# EAGLE design sa_amp (EAGLE 9.6.2)
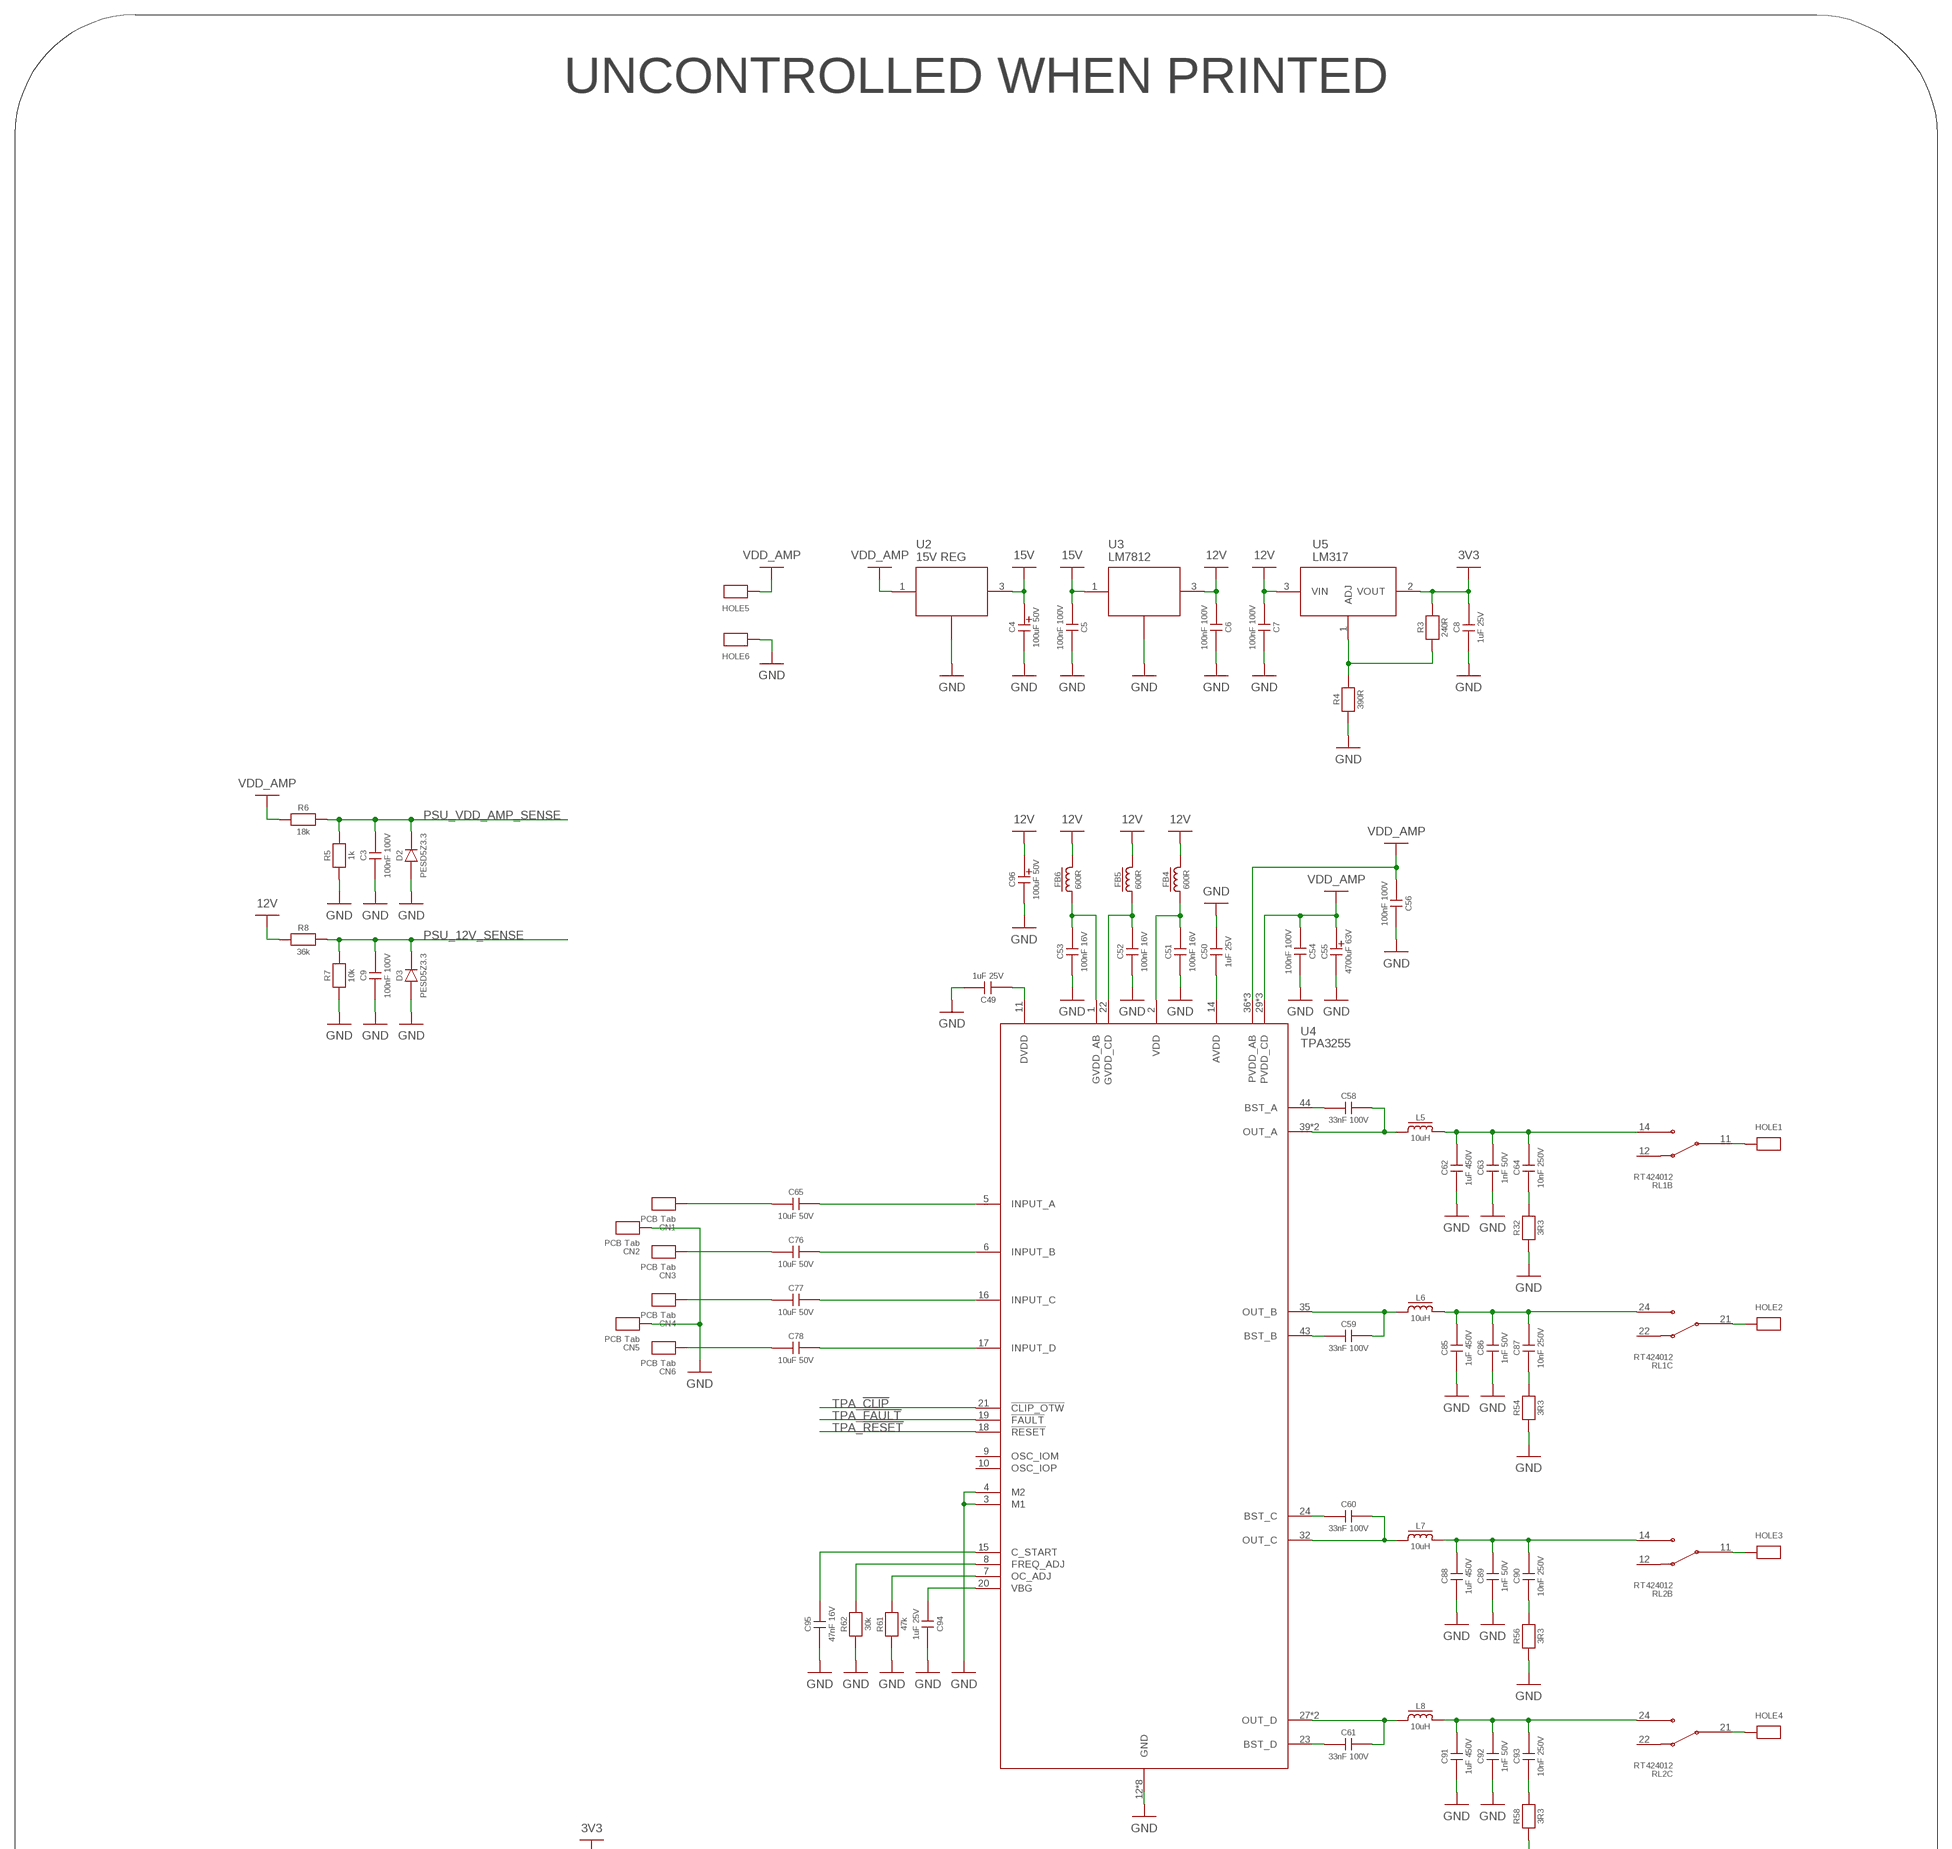
[diagram p0: schematic, sheet 1, part 1 of 2]
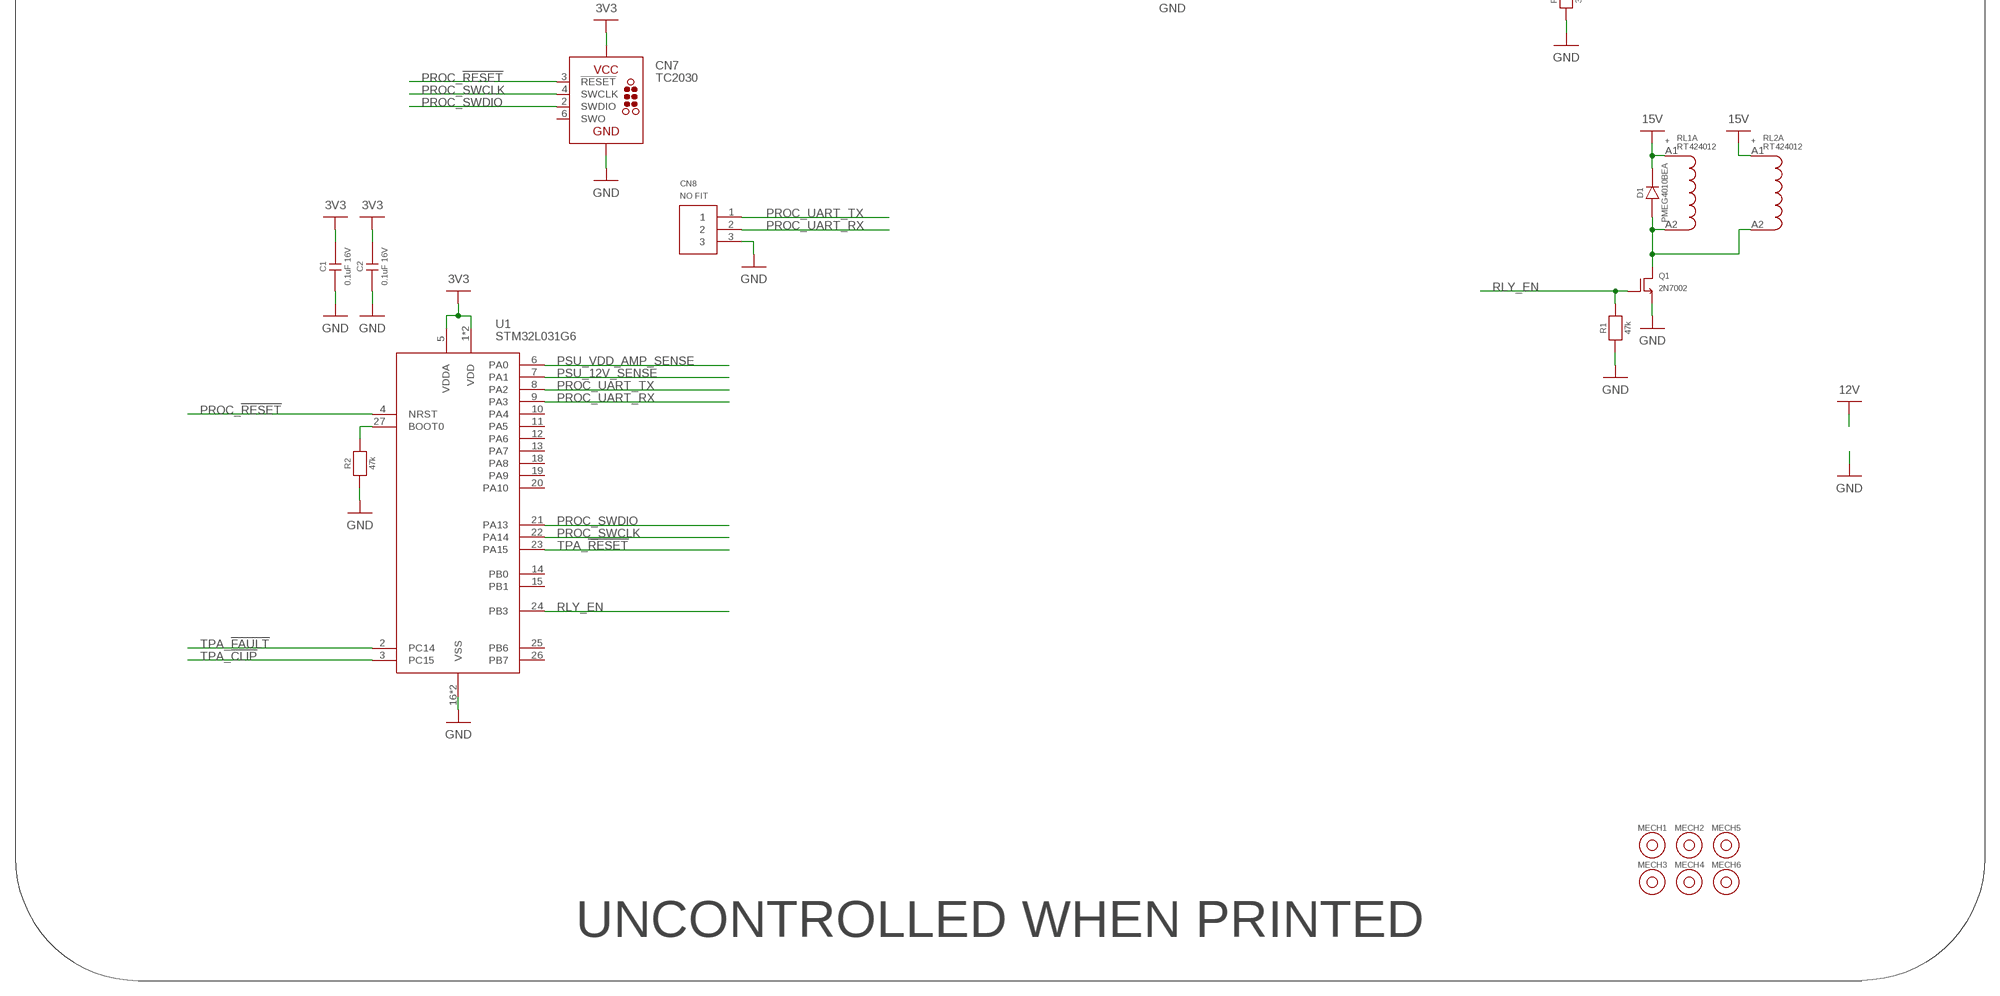
[diagram p1: schematic, sheet 1, part 2 of 2]

## Parts
C1  0.1uF 16V  0603YC104K4T4A  [0603]
C2  0.1uF 16V  0603YC104K4T4A  [0603]
C3  100nF 100V  06031C104KAT2A  [0603]
C4  100uF 50V  107CKR050M  [8MM_RADIAL_3.5MM_PITCH]
C5  100nF 100V  06031C104KAT2A  [0603]
C6  100nF 100V  06031C104KAT2A  [0603]
C7  100nF 100V  06031C104KAT2A  [0603]
C8  1uF 25V  CL10A105KA8NNNC  [0603]
C9  100nF 100V  06031C104KAT2A  [0603]
C49  1uF 25V  CL10A105KA8NNNC  [0603]
C50  1uF 25V  CL10A105KA8NNNC  [0603]
C51  100nF 16V  CL10B104KO8WPNC  [0603]
C52  100nF 16V  CL10B104KO8WPNC  [0603]
C53  100nF 16V  CL10B104KO8WPNC  [0603]
C54  100nF 100V  06031C104KAT2A  [0603]
C55  4700uF 63V  B41231C8478M000  [30MM_RADIAL_10MM_PITCH]
C56  100nF 100V  06031C104KAT2A  [0603]
C58  33nF 100V  C0603C333K1RACTU  [0603]
C59  33nF 100V  C0603C333K1RACTU  [0603]
C60  33nF 100V  C0603C333K1RACTU  [0603]
C61  33nF 100V  C0603C333K1RACTU  [0603]
C62  1uF 450V  ECWFE2W105K  [7X17.5BOX]
C63  1nF 50V  CL10B102KB8NNNC  [0603]
C64  10nF 250V  885342206006  [0603]
C65  10uF 50V  MKS2B051001N00JSSD  [7.2X11BOX]
C76  10uF 50V  MKS2B051001N00JSSD  [7.2X11BOX]
C77  10uF 50V  MKS2B051001N00JSSD  [7.2X11BOX]
C78  10uF 50V  MKS2B051001N00JSSD  [7.2X11BOX]
C85  1uF 450V  ECWFE2W105K  [7X17.5BOX]
C86  1nF 50V  CL10B102KB8NNNC  [0603]
C87  10nF 250V  885342206006  [0603]
C88  1uF 450V  ECWFE2W105K  [7X17.5BOX]
C89  1nF 50V  CL10B102KB8NNNC  [0603]
C90  10nF 250V  885342206006  [0603]
C91  1uF 450V  ECWFE2W105K  [7X17.5BOX]
C92  1nF 50V  CL10B102KB8NNNC  [0603]
C93  10nF 250V  885342206006  [0603]
C94  1uF 25V  CL10A105KA8NNNC  [0603]
C95  47nF 16V  CL10B473KO8NNNC  [0603]
C96  100uF 50V  107CKR050M  [8MM_RADIAL_3.5MM_PITCH]
CN1  PCB Tab  PCB_TAB_SMALL  [PCB_TAB_SMALL]
CN2  PCB Tab  PCB_TAB_SMALL  [PCB_TAB_SMALL]
CN3  PCB Tab  PCB_TAB_SMALL  [PCB_TAB_SMALL]
CN4  PCB Tab  PCB_TAB_SMALL  [PCB_TAB_SMALL]
CN5  PCB Tab  PCB_TAB_SMALL  [PCB_TAB_SMALL]
CN6  PCB Tab  PCB_TAB_SMALL  [PCB_TAB_SMALL]
CN7  TC2030  TC2030-MCP  [TC2030-MCP]
CN8  NO FIT  1X3_HEADER  [3PIN_HEADER]
D1  PMEG4010BEA  [SOD-323]
D2  PESD5Z3.3  [SC-79]
D3  PESD5Z3.3  [SC-79]
FB4  600R  742792651  [0603]
FB5  600R  742792651  [0603]
FB6  600R  742792651  [0603]
HOLE1  PCB Tab  PCB_TAB  [PCB_TAB]
HOLE2  PCB Tab  PCB_TAB  [PCB_TAB]
HOLE3  PCB Tab  PCB_TAB  [PCB_TAB]
HOLE4  PCB Tab  PCB_TAB  [PCB_TAB]
HOLE5  PCB Tab  PCB_TAB  [PCB_TAB]
HOLE6  PCB Tab  PCB_TAB  [PCB_TAB]
L5  10uH  SRP1265A-100M  [SRP1265A]
L6  10uH  SRP1265A-100M  [SRP1265A]
L7  10uH  SRP1265A-100M  [SRP1265A]
L8  10uH  SRP1265A-100M  [SRP1265A]
MECH1  6mm x 3mm  MOUNTHOLE  [MOUNTHOLE_6X3]
MECH2  6mm x 3mm  MOUNTHOLE  [MOUNTHOLE_6X3]
MECH3  6mm x 3mm  MOUNTHOLE  [MOUNTHOLE_6X3]
MECH4  6mm x 3mm  MOUNTHOLE  [MOUNTHOLE_6X3]
MECH5  6mm x 3mm  MOUNTHOLE  [MOUNTHOLE_6X3]
MECH6  6mm x 3mm  MOUNTHOLE  [MOUNTHOLE_6X3]
Q1  2N7002  2N7002P,215  [SOT23-3]
R1  47k  ERJ3EKF4702V  [0603]
R2  47k  ERJ3EKF4702V  [0603]
R3  240R  CRCW0603240RFKEA  [0603]
R4  390R  CRCW0603390RFKEA  [0603]
R5  1k  CRCW06031K00FKEB  [0603]
R6  18k  CRCW060318K0FKEA  [0603]
R7  10k  CRCW060310K0FKTA  [0603]
R8  36k  CRCW060336K0FKEA  [0603]
R32  3R3  RL73H3AR10FTDF  [2512]
R54  3R3  RL73H3AR10FTDF  [2512]
R56  3R3  RL73H3AR10FTDF  [2512]
R58  3R3  RL73H3AR10FTDF  [2512]
R61  47k  ERJ3EKF4702V  [0603]
R62  30k  ERJ3EKF3002V  [0603]
RL1  RT424012  [30MMDPDTRELAY]
RL2  RT424012  [30MMDPDTRELAY]
U1  STM32L031G6  [UFQPN28]
U2  15V REG  SRH05S15  [SRH05]
U3  LM7812  7812CTG  [TO220]
U4  TPA3255  [HTSSOP44]
U5  LM317  LM317LCPK  [SOT89]

## Nets
3V3: C1.2 C2.2 C8.2 CN7.1(VCC) R3.2 U1.1(VDD) U1.5(VDDA) U1.17(VDD) U5.2(VOUT)
12V: C6.1 C7.1 C96.P(A) FB4.2 FB5.2 FB6.2 R8.1 U3.3(VOUT) U5.3(VIN)
15V: C4.P(A) C5.1 D1.K RL1.A1(A:A1) RL2.A1(A:A1) U2.3(VOUT) U3.1(VIN)
GND: C1.1 C2.1 C3.2 C4.N(K) C5.2 C6.2 C7.2 C8.1 C9.2 C49.2 C50.2 C51.1 C52.1 C53.1 C54.2 C55.1(K) C56.2 C62.1 C63.1 C85.1 C86.1 C88.1 C89.1 C91.1 C92.1 C94.2 C95.1 C96.N(K) CN2.1 CN5.1 CN7.5(GND) CN8.3 D2.A D3.A HOLE6.1 Q1.3(S) R1.1 R2.1 R4.1 R5.1 R7.1 R32.1 R54.1 R56.1 R58.1 R61.1 R62.1 U1.16(VSS) U1.28(VSS) U2.2(GND) U3.2(GND) U4.3(M1) U4.4(M2) U4.12(GND) U4.13(GND) U4.25(GND) U4.26(GND) U4.33(GND) U4.34(GND) U4.41(GND) U4.42(GND)
N$1: C50.1 U4.14(AVDD)
N$2: C91.2 C92.2 C93.2 L8.2 RL2.24
N$3: HOLE4.1 RL2.21
N$4: HOLE1.1 RL1.11
N$5: HOLE2.1 RL1.21
N$6: HOLE3.1 RL2.11
N$8: R2.2 U1.27(BOOT0)
N$9: D1.A Q1.2(D) RL1.A2(A:A2) RL2.A2(A:A2)
N$13: R3.1 R4.2 U5.1(ADJ)
N$14: C49.1 U4.11(DVDD)
N$16: C78.1 CN6.1
N$17: C76.1 CN3.1
N$18: C77.1 CN4.1
N$25: C51.2 FB4.1 U4.2(VDD)
N$31: C52.2 FB5.1 U4.22(GVDD_CD)
N$51: C53.2 FB6.1 U4.1(GVDD_AB)
N$52: C61.1 U4.23(BST_D)
N$53: C61.2 L8.1 U4.27(OUT_D) U4.28(OUT_D)
N$54: C60.1 U4.24(BST_C)
N$55: C60.2 L7.1 U4.32(OUT_C)
N$56: C59.1 U4.43(BST_B)
N$57: C59.2 L6.1 U4.35(OUT_B)
N$58: C58.1 U4.44(BST_A)
N$59: C58.2 L5.1 U4.39(OUT_A) U4.40(OUT_A)
N$60: C64.1 R32.2
N$61: C65.2 U4.5(INPUT_A)
N$62: C65.1 CN1.1
N$63: C62.2 C63.2 C64.2 L5.2 RL1.14
N$75: C76.2 U4.6(INPUT_B)
N$76: C77.2 U4.16(INPUT_C)
N$77: C78.2 U4.17(INPUT_D)
N$79: C85.2 C86.2 C87.2 L6.2 RL1.24
N$82: C88.2 C89.2 C90.2 L7.2 RL2.14
N$87: C87.1 R54.2
N$88: C90.1 R56.2
N$89: C93.1 R58.2
N$91: C94.1 U4.20(VBG)
N$92: R61.2 U4.7(OC_ADJ)
N$93: R62.2 U4.8(FREQ_ADJ)
N$94: C95.2 U4.15(C_START)
PROC_!RESET: CN7.3(!RESET) U1.4(NRST)
PROC_SWCLK: CN7.4(SWCLK) U1.22(PA14)
PROC_SWDIO: CN7.2(SWDIO) U1.21(PA13)
PROC_UART_RX: CN8.2 U1.9(PA3)
PROC_UART_TX: CN8.1 U1.8(PA2)
PSU_12V_SENSE: C9.1 D3.K R7.2 R8.2 U1.7(PA1)
PSU_VDD_AMP_SENSE: C3.1 D2.K R5.2 R6.2 U1.6(PA0)
RLY_EN: Q1.1(G) R1.2 U1.24(PB3)
TPA_!CLIP: U1.3(PC15) U4.21(!CLIP_OTW)
TPA_!FAULT: U1.2(PC14) U4.19(!FAULT)
TPA_!RESET: U1.23(PA15) U4.18(!RESET)
VDD_AMP: C54.1 C55.2(A) C56.1 HOLE5.1 R6.1 U2.1(VIN) U4.29(PVDD_CD) U4.30(PVDD_CD) U4.31(PVDD_CD) U4.36(PVDD_AB) U4.37(PVDD_AB) U4.38(PVDD_AB)
Unconnected: CN7.6(SWO) RL1.12 RL1.22 RL2.12 RL2.22 U1.10(PA4) U1.11(PA5) U1.12(PA6) U1.13(PA7) U1.14(PB0) U1.15(PB1) U1.18(PA8) U1.19(PA9) U1.20(PA10) U1.25(PB6) U1.26(PB7) U4.9(OSC_IOM) U4.10(OSC_IOP)

## Notes on the sheet
- UNCONTROLLED WHEN PRINTED
- UNCONTROLLED WHEN PRINTED

## Library data of the parts
C1 C2 = c_0603:0603YC104K4T4A: 100000 16V 0.1µF ±10% X7R 0603; DIGIKEY: 478-9382-1-ND; HEIGHT: -; MANUFACTURER: AVX Corporation; PRICE_PER: 0.08000; STOCK: 176486; TEMP_CO: X7R; TOLERANCE: ±10%; VOLTAGE: 16V
C3 C5-C7 C9 C54 C56 = CAPACITORS:06031C104KAT2A: 100nF 100V X7R 10% 0603 MLCC.; DIGIKEY: 478-10047-1-ND; HEIGHT: 1; PRICE_PER: 0.14
C4 C96 = CAPACITORS:107CKR050M: 100uF 50V Electrolytic 20% 8mm radial.; DIGIKEY: 1572-1044-ND; HEIGHT: 14; PRICE_PER: 0.223
C8 C49 C50 C94 = CAPACITORS:CL10A105KA8NNNC: 1uF 25V X5R 10% 0603 MLCC.; DIGIKEY: 1276-1102-1-ND; HEIGHT: 1; PRICE_PER: 0.08
C51-C53 = CAPACITORS:CL10B104KO8WPNC: 100nF 16V X7R 10% 0603 MLCC; DIGIKEY: 1276-6582-1-ND; HEIGHT: 1; PRICE_PER: 0.08
C55 = CAPACITORS:B41231C8478M000: 4700uF 63V Electrolytic 20% 10mm radial.; DIGIKEY: 495-6169-ND; HEIGHT: 37; PRICE_PER: 2.62
C58-C61 = CAPACITORS:C0603C333K1RACTU: 33nF 100V X7R 10% 0603 MLCC.; DIGIKEY: 399-3478-1-ND; HEIGHT: 1; PRICE_PER: 0.214
C62 C85 C88 C91 = CAPACITORS:ECWFE2W105K: 1uF 450V Film 10% box; DIGIKEY: P16845-ND; HEIGHT: 13; PRICE_PER: 0.49
C63 C86 C89 C92 = CAPACITORS:CL10B102KB8NNNC: 1nF 50V X7R 10% 0603 MLCC.; DIGIKEY: 1276-1018-1-ND; HEIGHT: 1; PRICE_PER: 0.08
C64 C87 C90 C93 = CAPACITORS:885342206006: 10nF 250V X7R 10% 0603 MLCC.; DIGIKEY: 732-12168-1-ND; HEIGHT: 1; PRICE_PER: 0.09
C65 C76-C78 = CAPACITORS:MKS2B051001N00JSSD: 10uF 50V FILM +/-5% 7.2 x 11mm BOX; DIGIKEY: 1928-1631-ND; HEIGHT: 16; PRICE_PER: 2.22
C95 = CAPACITORS:CL10B473KO8NNNC: 47nF 16V X7R 10% 0603 MLCC.; DIGIKEY: 1276-2079-1-ND; HEIGHT: 1; PRICE_PER: 0.08
CN1-CN6 = CONNECTORs:PCB_TAB_SMALL: PCB tab for soldering. Built into the PCB.; HEIGHT: 2; PRICE_PER: 0
CN7 = tag-connect:TC2030: TAG-CONNECT ICSP Connector Manufacturer: Tag-Connect <http://www.tag-connect.com> Cable for easy In-Circuit Serial Programming. Designed for Microchip ICD2, suitable for many others. Two variants - one "with legs" (for hands-free fit on PCB) and another "without legs" for quick programming.; HEIGHT: 0; PRICE_PER: 0
CN8 = CONNECTORs:1X3_HEADER: A 1 row, 3 column, 3 pin 0.1" header.; VALUE: 1 X 3 HEADER
D1 = DIODES:PMEG4010BEA: 1A, 40V Schottkey rectifier. SOD323.; DIGIKEY: 1727-5211-1-ND; HEIGHT: 1.2; PRICE_PER: 0.29
D2 D3 = DIODES:PESD5Z3.3: Low capacitance unidirectional ElectroStatic Discharge (ESD) protection diode. 3.3V.; DIGIKEY: 1727-5814-1-ND; HEIGHT: 0.5; PRICE_PER: 0.28
FB4-FB6 = INDUCTORS:742792651: Ferrite Bead 600R at 100MHz 0603.; DIGIKEY: 732-1593-1-ND; HEIGHT: 1; PRICE_PER: 0.13
HOLE1-HOLE6 = CONNECTORs:PCB_TAB: PCB tab for soldering. Built into the PCB.; HEIGHT: 2; PRICE_PER: 0
L5-L8 = INDUCTORS:SRP1265A-100M: Power Inductor (SMD), 10 µH, 10 A, Shielded, 15.5 A, SRP1265A Series, 13.5mm x 12.5mm x 6.2mm; DIGIKEY: SRP1265A-100MCT-ND; HEIGHT: 6.2; PRICE_PER: 1.32
MECH1-MECH6 = MISC:MOUNTHOLE: Mechanical mounting hole.
Q1 = TRANSISTORs:2N7002: N-Channel 60V 360mA (Ta) 350mW (Ta) Surface Mount TO-236AB (SOT23); DIGIKEY: 1727-4692-1-ND; HEIGHT: 1; PRICE_PER: 0.15
R1 R2 R61 = r_0603:ERJ3EKF4702V: 47000 47k 0603 0.1W 1% thick film resistor.; DIGIKEY: P47.0KHCT-ND; PRICE_PER: 0.10000
R3 = r_0603:CRCW0603240RFKEA: 240 ±1% 240 Ohms Thick Film 0.1W, 1/10W 0603; DIGIKEY: 541-240HCT-ND; HEIGHT: 1; MANUFACTURER: Vishay Dale; POWER: 0.1W, 1/10W; PRICE_PER: 0.07000; STOCK: 4057; TOLERANCE: ±1%
R4 = r_0603:CRCW0603390RFKEA: 390 ±1% 390 Ohms Thick Film 0.1W, 1/10W 0603; DIGIKEY: 541-390HCT-ND; HEIGHT: 1; MANUFACTURER: Vishay Dale; POWER: 0.1W, 1/10W; PRICE_PER: 0.07000; STOCK: 1304; TOLERANCE: ±1%
R5 = r_0603:CRCW06031K00FKEB: 1000 ±1% 1k Thick Film 0.1W, 1/10W 0603; DIGIKEY: 541-2985-1-ND; HEIGHT: 1; MANUFACTURER: Vishay Dale; POWER: 0.1W, 1/10W; PRICE_PER: 0.07000; STOCK: 1537; TOLERANCE: ±1%
R6 = r_0603:CRCW060318K0FKEA: 18000 ±1% 18k Thick Film 0.1W, 1/10W 0603; DIGIKEY: 541-18.0KHCT-ND; HEIGHT: 1; MANUFACTURER: Vishay Dale; POWER: 0.1W, 1/10W; PRICE_PER: 0.07000; STOCK: 18000; TOLERANCE: ±1%
R7 = r_0603:CRCW060310K0FKTA: 10000 ±1% 10k Thick Film 0.1W, 1/10W 0603; DIGIKEY: 541-2980-1-ND; HEIGHT: 1; MANUFACTURER: Vishay Dale; POWER: 0.1W, 1/10W; PRICE_PER: 0.12000; STOCK: 50797; TOLERANCE: ±1%
R8 = r_0603:CRCW060336K0FKEA: 36000 ±1% 36k Thick Film 0.1W, 1/10W 0603; DIGIKEY: 541-36.0KHCT-ND; HEIGHT: 1; MANUFACTURER: Vishay Dale; POWER: 0.1W, 1/10W; PRICE_PER: 0.07000; STOCK: 961; TOLERANCE: ±1%
R32 R54 R56 R58 = RESISTORS:RL73H3AR10FTDF: 0.1 0.1R 2512 1W 1%; DIGIKEY: A138604CT-ND; HEIGHT: 1; PRICE_PER: 0.47; VALUE: 0R1
R62 = r_0603:ERJ3EKF3002V: 30000 30k 0603 0.1W 1% thick film resistor.; DIGIKEY: P30.0KHCT-ND; PRICE_PER: 0.10000
RL1 RL2 = ELECTROMECH:RT424012: General Purpose Relay DPDT (2 Form C) 12VDC Coil Through Hole; DIGIKEY: PB967-ND; HEIGHT: 16; PRICE_PER: 1.83
U1 = ICs:STM32L031G6: Access line ultra-low-power 32-bit MCU Arm®-based Cortex®-M0+, up to 32KB Flash, 8KB SRAM, 1KB EEPROM, ADC; DIGIKEY: 497-17485-ND; HEIGHT: 0.7; PRICE_PER: 1.71
U2 = ICs:SRH05S15: Linear Regulator Replacement DC DC Converter 1 Output 15V - - - 400mA 21V - 72V Input; DIGIKEY: 1470-4534-ND; HEIGHT: 10; PRICE_PER: 6
U3 = ICs:78: Linear Voltage Regulator, 78xx, Fixed, Positive, TO-220-3, 1.0 A Fixed Positive Voltage Regulators; FARNELL: 2296054; PRICE_PER: 0.391
U4 = ICs:TPA3255: 315-W Stereo, 600-W Mono PurePath™ Ultra-HD Analog-Input; DIGIKEY: 296-45124-5-ND; HEIGHT: 1.2; PRICE_PER: 8.67
U5 = ICs:LM317: Linear Voltage Regulator, Adjustable, 38V primary input, 1.2V to 32V/100 mA/1 Output; FARNELL: 2323454; PRICE_PER: 0.631

## Board
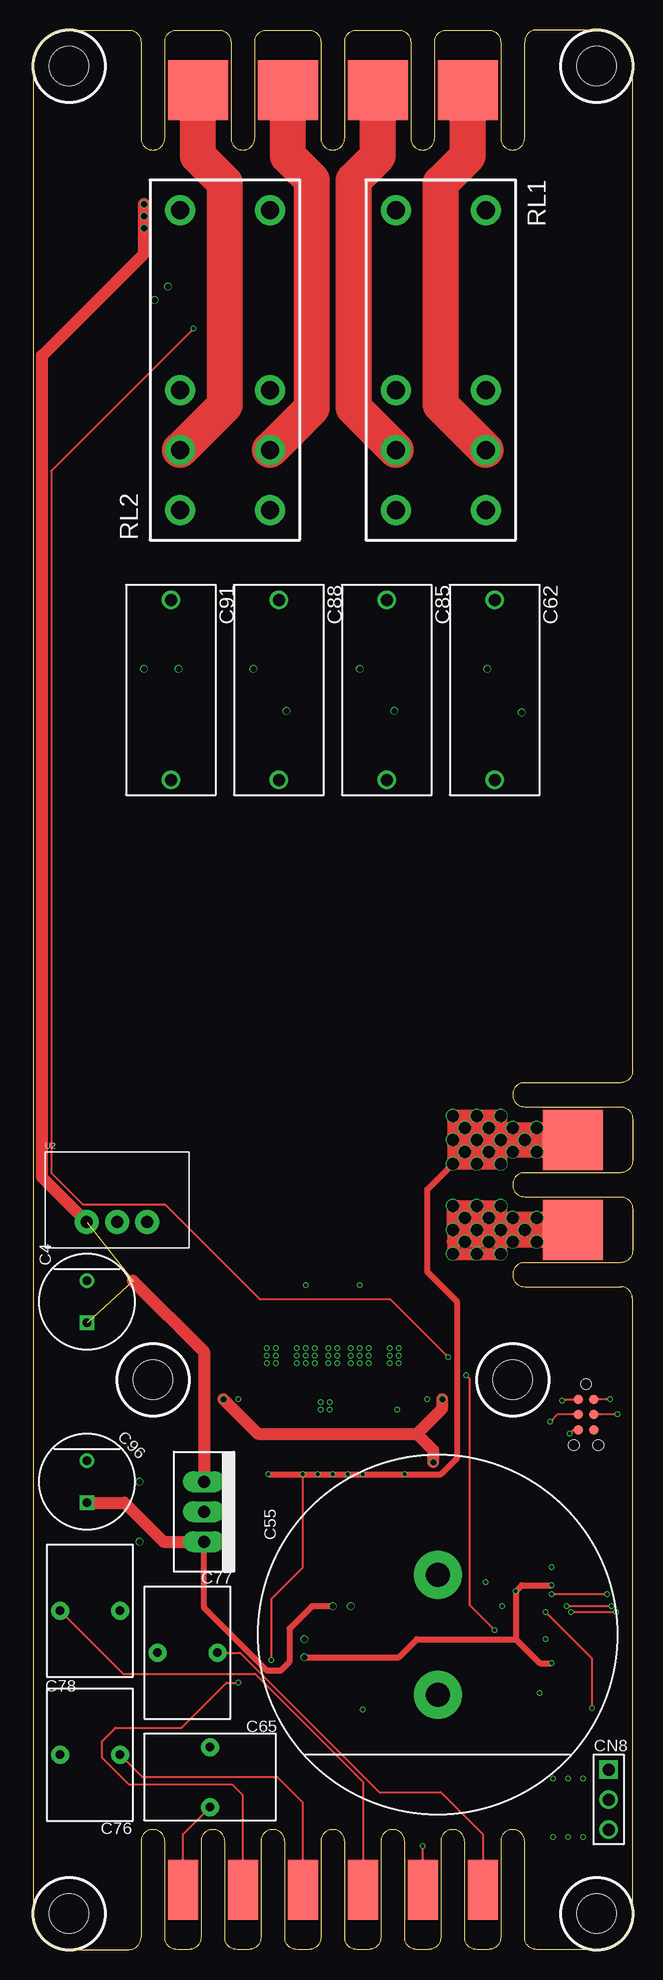
[diagram p2: board, top side]
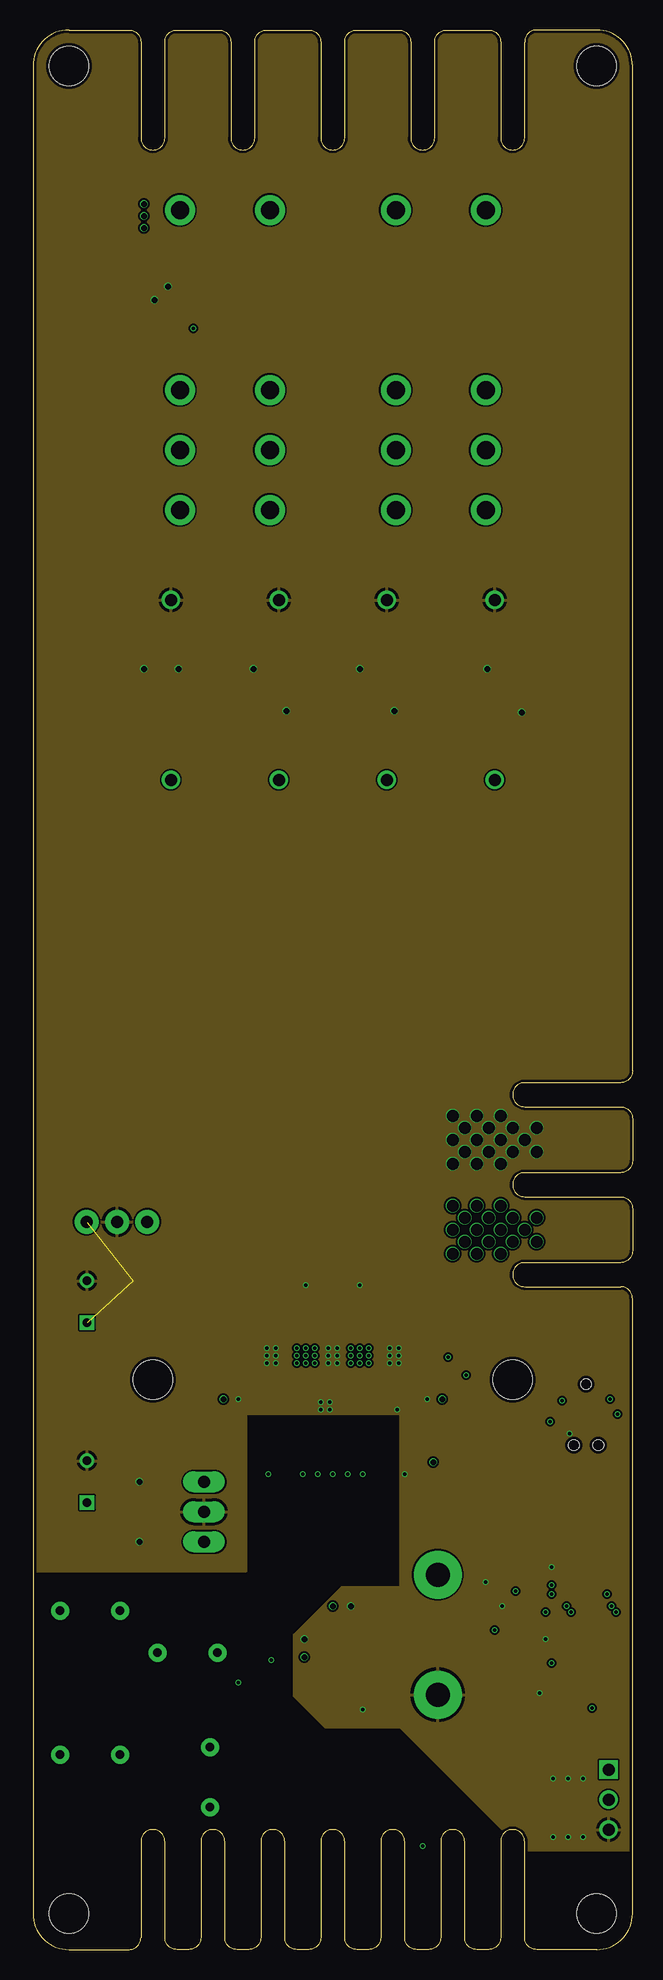
[diagram p3: board, inner layer GND]
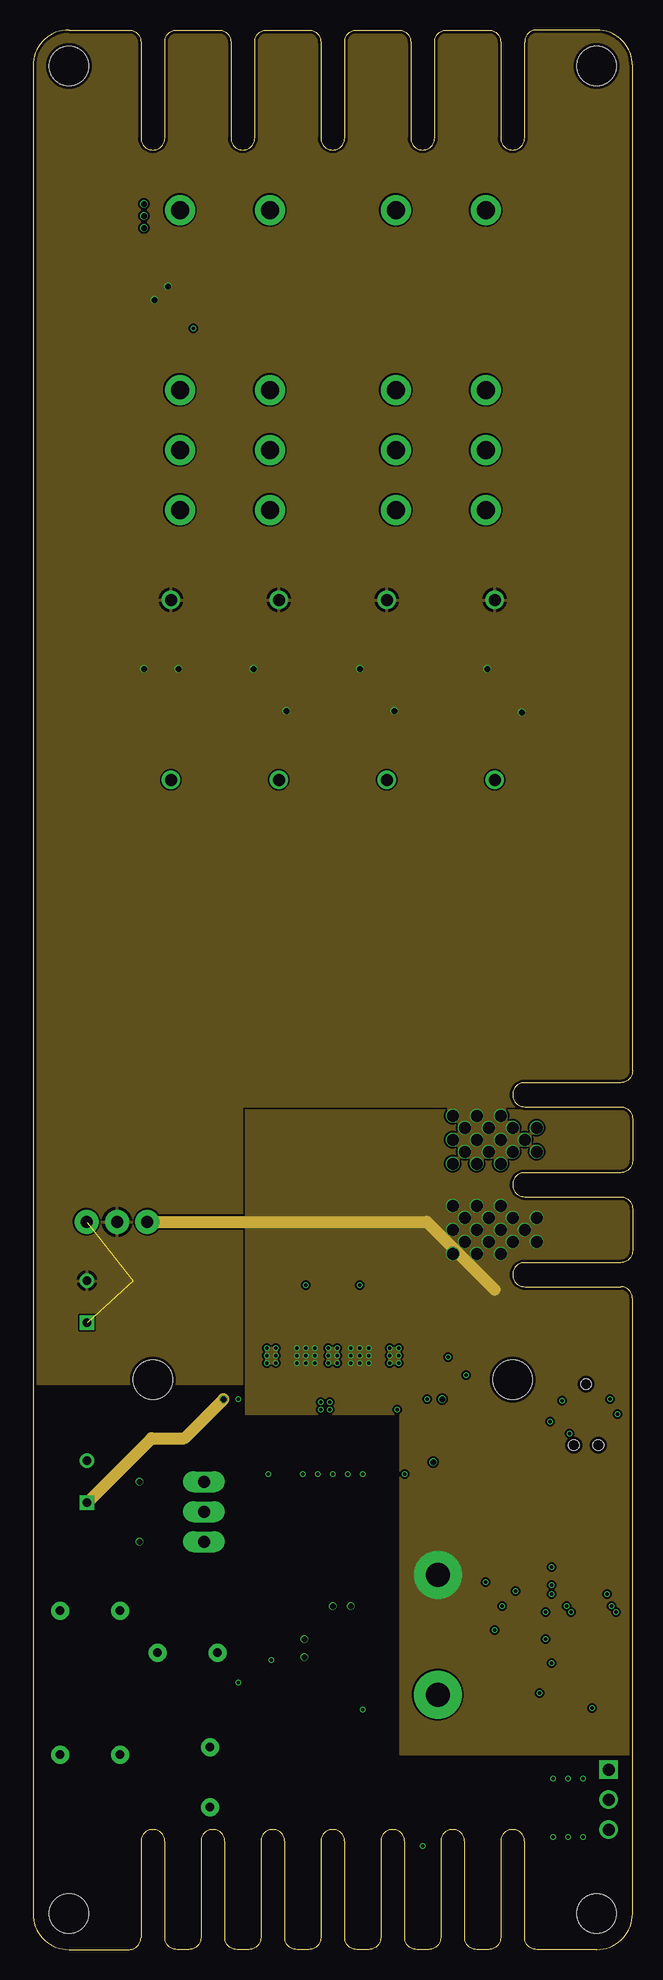
[diagram p4: board, inner layer PWR]
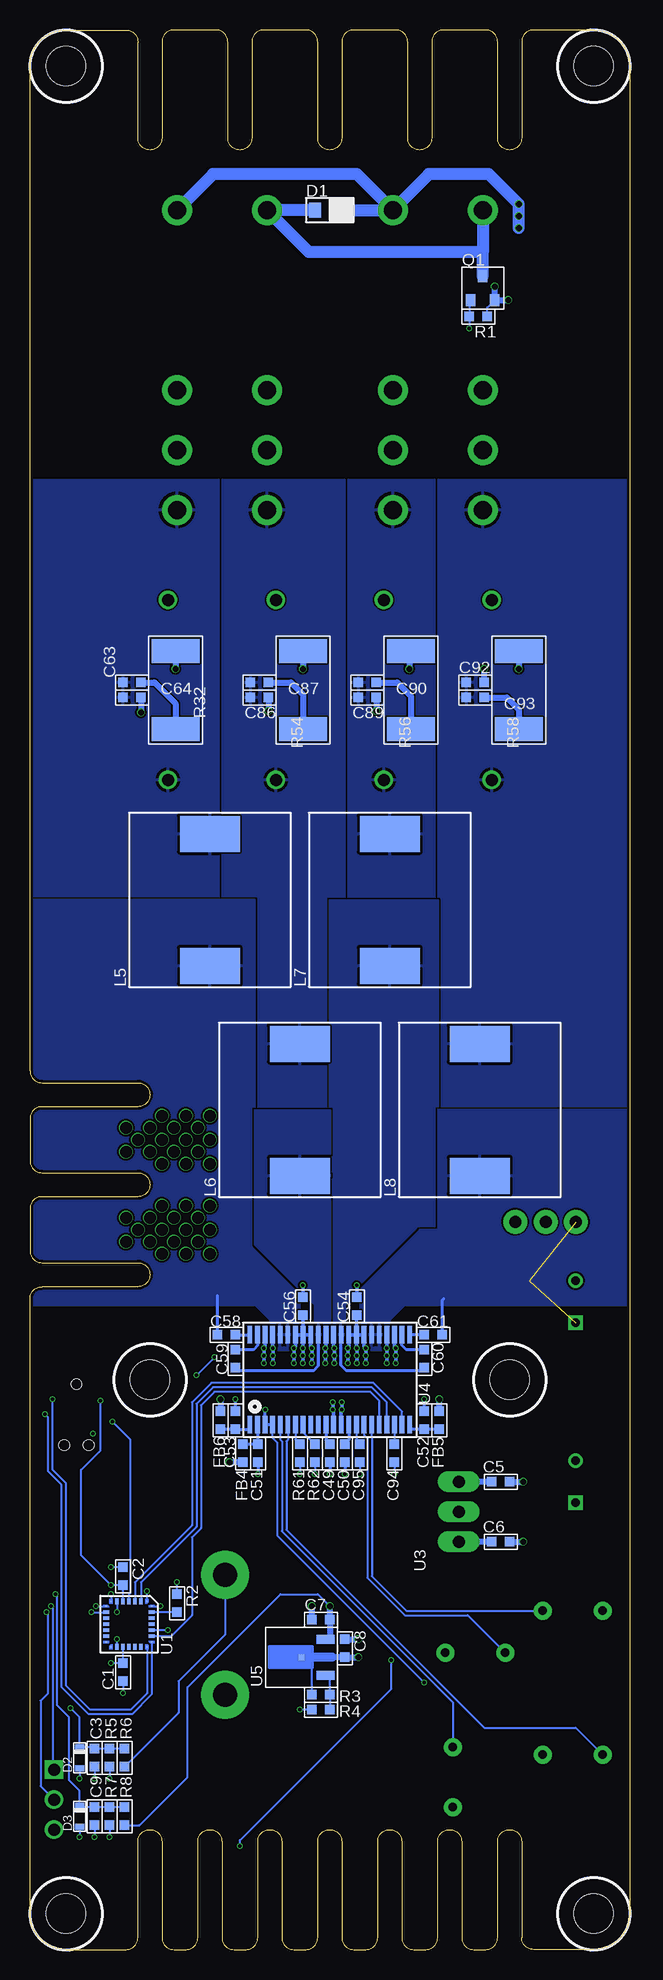
[diagram p5: board, bottom side, seen from below]

Size 50 x 160 mm. Coordinates in mm from the lower left corner, seen from the top.
Outline: 41,1 arc90 42,0 47,0 arc90 50,3 50,54.25 arc90 49,55.25
Outline: 9,1 arc-90 8,0 3,0 arc-90 0,3 0,157 arc-90 3,160 8,160 arc-90 9,159
Outline: 41,159 arc-90 42,160 47,160 arc-90 50,157 50,73.25 arc-90 49,72.25
Copper layers (1*2*3*16): Top 0.035mm / dielectric 1.5mm / GND 0.035mm / dielectric 0.15mm / PWR 0.035mm / dielectric 0.2mm / Bottom 0.035mm
Design rules "myDRC 4 layers 0.25mm": minimum track width 0.15mm, minimum drill 0.25mm, track to track 0.15mm, track to pad 0.15mm, pad to pad 0.15mm, via to via 0.15mm, smd to smd 0mil, copper to edge 0.25mm, drill to drill 0.25mm, minimum pad ring 10mil, minimum via ring 3mil, stop-mask expansion 4mil, vias tented up to drill 0.3mm, thermal gap 10mil

### Footprints (pad centres in the part's own frame; a part is rotated, then mirrored left to right if it is on the bottom)
0603 = smd 0.8 x 0.8: 1 -0.75,0; 2 0.75,0
8MM_RADIAL_3.5MM_PITCH = drill 0.7: N 1.75,0 | drill 0.7 square: P -1.75,0
30MM_RADIAL_10MM_PITCH = drill 2 pad 4: 1 5,0; 2 -5,0
7X17.5BOX = drill 1: 1 -7.5,0; 2 7.5,0
7.2X11BOX = drill 0.7 pad 1.5: 1 -2.5,0; 2 2.5,0
PCB_TAB_SMALL = smd 2.5 x 5: 1 0,0
TC2030-MCP = smd 0.787 x 0.787: 1 1.27,-0.635; 2 1.27,0.635; 3 2.54,-0.635; 4 2.54,0.635; 5 3.81,-0.635; 6 3.81,0.635 | hole 0.889: 0,0; 5.08,-1.016; 5.08,1.016
3PIN_HEADER = drill 1 pad 1.5 square: 1 0,2.5 | drill 1 pad 1.5: 2 0,0; 3 0,-2.5
SOD-323 = smd 1 x 1.25: A -1.25,0; K 1.25,0
SC-79 = smd 0.75 x 0.5: A 0,-0.875; K 0,0.875
PCB_TAB = smd 5 x 5: 1 0,0
SRP1265A = smd 3 x 5: 1 -5.5,0; 2 5.5,0
MOUNTHOLE_6X3 = hole 3.3: 0,0
SOT23-3 = smd 0.8 x 1: 1 -1,-1; 2 0,1; 3 1,-1
2512 = smd 2 x 4: 1 -3.25,0; 2 3.25,0
30MMDPDTRELAY = drill 1.5 pad 2.5: 11 7.5,3.75; 12 2.5,3.75; 14 12.5,3.75; 21 7.5,-3.75; 22 2.5,-3.75; 24 12.5,-3.75; A1 -12.5,3.75; A2 -12.5,-3.75
UFQPN28 = smd 0.15 x 0.15: 1 -1.9,1.5; 7 -1.9,-1.5; 8 -1.5,-1.9; 14 1.5,-1.9; 15 1.9,-1.5; 21 1.9,1.5; 22 1.5,1.9; 28 -1.5,1.9 | smd 0.5 x 0.3: 2 -1.9,1; 3 -1.9,0.5; 4 -1.9,0; 5 -1.9,-0.5; 6 -1.9,-1; 16 1.9,-1; 17 1.9,-0.5; 18 1.9,0; 19 1.9,0.5; 20 1.9,1 | smd 0.3 x 0.5: 9 -1,-1.9; 10 -0.5,-1.9; 11 0,-1.9; 12 0.5,-1.9; 13 1,-1.9; 23 1,1.9; 24 0.5,1.9; 25 0,1.9; 26 -0.5,1.9; 27 -1,1.9
SRH05 = drill 1 pad 2: 1 2.54,-1.85; 2 0,-1.85; 3 -2.54,-1.85
TO220 = drill 1 pad 1.75 long: 1 -2.5,0; 2 0,0; 3 2.5,0
HTSSOP44 = smd 1.45 x 0.4: 1 -3.75,6.668; 2 -3.75,6.032; 3 -3.75,5.397; 4 -3.75,4.763; 5 -3.75,4.128; 6 -3.75,3.493; 7 -3.75,2.857; 8 -3.75,2.223; 9 -3.75,1.587; 10 -3.75,0.953; 11 -3.75,0.318; 12 -3.75,-0.318; 13 -3.75,-0.953; 14 -3.75,-1.587; 15 -3.75,-2.223; 16 -3.75,-2.857; 17 -3.75,-3.493; 18 -3.75,-4.128; 19 -3.75,-4.763; 20 -3.75,-5.397; 21 -3.75,-6.032; 22 -3.75,-6.668; 23 3.75,-6.668; 24 3.75,-6.032; 25 3.75,-5.397; 26 3.75,-4.763; 27 3.75,-4.128; 28 3.75,-3.493; 29 3.75,-2.857; 30 3.75,-2.223; 31 3.75,-1.587; 32 3.75,-0.953; 33 3.75,-0.318; 34 3.75,0.318; 35 3.75,0.953; 36 3.75,1.587; 37 3.75,2.223; 38 3.75,2.857; 39 3.75,3.493; 40 3.75,4.128; 41 3.75,4.763; 42 3.75,5.397; 43 3.75,6.032; 44 3.75,6.668
SOT89 = smd 0.75 x 1.5: 1 -1.5,-2.25; 3 1.5,-2.25 | smd 0.5 x 0.5: 2 0,-0.25

### Placement (x,y rotation side)
C1  42.25,23.12 90 bottom
C2  42.25,31.12 270 bottom
C3  44.62,16 270 bottom
C4  4.5,54 90 top
C5  10.75,39 0 bottom
C6  10.75,34 0 bottom
C7  25.75,27.5 180 bottom
C8  23.75,25.12 270 bottom
C9  44.62,11.12 270 bottom
C49  25,41.38 270 bottom
C50  23.75,41.38 270 bottom
C51  31,41.38 90 bottom
C52  17.12,44.12 270 bottom
C53  32.88,44.12 270 bottom
C54  22.75,53.62 90 bottom
C55  33.75,26.25 270 top
C56  27.25,53.62 90 bottom
C58  33.62,51.25 180 bottom
C59  32.88,49.25 270 bottom
C60  17.12,49.25 270 bottom
C61  16.38,51.25 0 bottom
C62  38.5,105 270 top
C63  41.5,104.38 180 bottom
C64  41.5,105.62 180 bottom
C65  14.75,14.38 90 top
C76  4.75,16.25 180 top
C77  12.88,24.75 180 top
C78  4.75,28.25 0 top
C85  29.5,105 270 top
C86  30.88,104.38 180 bottom
C87  30.88,105.62 180 bottom
C88  20.5,105 270 top
C89  21.88,104.38 180 bottom
C90  21.88,105.62 180 bottom
C91  11.5,105 270 top
C92  12.88,105.62 180 bottom
C93  12.88,104.38 180 bottom
C94  19.62,41.38 270 bottom
C95  22.5,41.38 90 bottom
C96  4.5,39 90 top
CN1  12.5,5 180 top
CN2  32.5,5 180 top
CN3  22.5,5 180 top
CN4  37.5,5 180 top
CN5  17.5,5 180 top
CN6  27.5,5 180 top
CN7  46.12,47.12 270 top
CN8  48,12.5 0 top
D1  25,145 0 bottom
D2  45.88,16 0 bottom
D3  45.88,11.12 0 bottom
FB4  32.25,41.38 270 bottom
FB5  15.88,44.12 90 bottom
FB6  34.12,44.12 90 bottom
HOLE1  36.25,155 0 top
HOLE2  28.75,155 0 top
HOLE3  21.25,155 0 top
HOLE4  13.75,155 0 top
HOLE5  45,60 270 top
HOLE6  45,67.5 270 top
L5  35,87.5 90 bottom
L6  27.5,70 90 bottom
L7  20,87.5 90 bottom
L8  12.5,70 90 bottom
MECH1  47,3 90 top
MECH2  3,3 90 top
MECH3  47,157 90 top
MECH4  3,157 90 top
MECH5  10,47.5 90 top
MECH6  40,47.5 90 top
Q1  12.25,138.5 0 bottom
R1  12.62,136.12 180 bottom
R2  37.75,28.88 270 bottom
R3  25.75,21.25 180 bottom
R4  25.75,20 0 bottom
R5  43.38,16 90 bottom
R6  42.12,16 90 bottom
R7  43.38,11.12 90 bottom
R8  42.12,11.12 90 bottom
R32  37.88,105 270 bottom
R54  27.25,105 270 bottom
R56  18.25,105 270 bottom
R58  9.25,105 270 bottom
R61  27.5,41.38 90 bottom
R62  26.25,41.38 90 bottom
RL1  34,132.5 270 top
RL2  16,132.5 270 top
U1  41.75,27.12 270 bottom
U2  7,62.5 0 top
U3  14.25,36.5 270 top
U4  25,47.5 90 bottom
U5  27.62,24.38 90 bottom

### Tracks (layer width: path | path; a pad name or v marks a point on that pad's centre or on a via)
3V3  (via drill 0.3, 0.5)
  Top 0.15: v44.12,45.75 44.23,45.85 CN7.1
  Top 0.5: v22.62,24.38 30.5,24.38 32,25.88 40.25,25.88 | v43.25,30.38 40.75,30.38 v40.25,29.88 40.25,25.88 | 40.25,25.88 C1.2 v43.25,23.88
  Bottom 0.15: U1.5 C2.2 v43.25,30.38 45.75,32.88 45.75,40 44.12,41.62 v44.12,45.75 | U1.1 v40.25,29.88 | U1.17 C1.2 v43.25,23.88 | R3.2 26.5,23.5 U5.2
  Bottom 0.5: U5.2 C8.2 v22.62,24.38
12V  (via drill 0.5)
  Top 0.5: v25,28.62 23.25,28.62 21.38,26.75 21.38,24 20.62,23.25 19.5,23.25 14.25,28.5 U3.3
  Top 1: C96.P 7.62,37.25 10.88,34 U3.3 | v15.88,45.88 18.75,43 32,43 | 32,43 33.38,41.62 v33.38,40.62 | 32,43 34.12,45.12 v34.12,45.88
  PWR 1: C96.P 9.88,42.62 12.62,42.62 v15.88,45.88
  Bottom 0.15: R8.1 40.88,10.38 36.88,14.38 36.88,21.88 29.12,29.62 26,29.62 v25,28.62
  Bottom 0.5: C6.1 U3.3 | v34.12,45.88 FB6.2 | FB4.2 v33.38,40.62 | FB5.2 v15.88,45.88 | U5.3 25,25.88 C7.1 v25,28.62
15V  (via drill 0.5)  (2 unrouted)
  Top 1: 4.5,60.61 U2.3 0.75,64.36 0.75,132.88 9.25,141.38 v9.25,143.5 v9.25,144.5 v9.25,145.5 | U3.1 14.25,49.85 8.35,55.75
  Bottom 0.5: C5.1 U3.1
  Bottom 1: v9.25,143.5 v9.25,144.5 v9.25,145.5 11.75,148 16.75,148 RL2.A1 | RL2.A1 22.75,148 34.75,148 RL1.A1 | D1.K RL2.A1
GND  (via drill 0.3, 0.5, 1)
  Top 0.15: CN2.1 v32.5,8.62 | v19.88,24.12 19.88,29.25 22.5,31.88 v22.5,39.62 | CN5.1 17.5,12.88 16.62,13.75 8,13.75 5.75,16 5.75,17.38 6.88,18.5 12.38,18.5 16.12,22.25 v17.12,22.25 | CN7.5 45.06,43.31 v44.75,43
  Top 0.5: v19.62,39.62 v22.5,39.62 v23.75,39.62 v25,39.62 v26.25,39.62 v27.5,39.62 34,39.62 35.38,41 35.38,54 32.88,56.5 32.88,63.38 v35,65.5
  Top 1: HOLE6.1 v41,67.5 v39,67.5 | v39,67.5 39,68.5 | 39,68.5 v39,69.5 v37,69.5 | v39,67.5 39,66.5 | 39,66.5 v39,65.5 v37,65.5 | v39,67.5 v37,67.5 | v37,69.5 37,68.5 | 37,68.5 v37,67.5 | v37,67.5 37,66.5 | 37,66.5 v37,65.5 | HOLE6.1 45,66.5 v42,66.5 v40,66.5 39,66.5 | 39,68.5 v40,68.5 v42,68.5 45,68.5 HOLE6.1 | 39,68.5 v38,68.5 37,68.5 | 39,66.5 v38,66.5 37,66.5 | v37,65.5 36,65.5 | 36,65.5 v35,65.5 v35,67.5 | v37,67.5 v35,67.5 | v37,69.5 36,69.5 | 36,69.5 v35,69.5 v35,67.5 | v37,67.5 36,67.5 | 36,69.5 v36,68.5 36,67.5 | 36,67.5 v36,66.5 36,65.5
  Bottom 0.15: R62.1 v26.25,39.62 | R61.1 v27.5,39.62 | C95.1 v22.5,39.62 | C94.2 v19.62,39.62 | R1.1 11.88,136.88 Q1.3 | v32.5,8.62 32.5,9.12 19.88,21.75 v19.88,24.12 | U4.4 29.76,42.64 29.38,42.25 29.38,34.5 v17.12,22.25 | R4.1 v27.5,20 | U1.16 v42.75,25.88 | U1.28 v39.12,28.62 | C1.1 v42.25,21.38 | C2.1 v43.25,31.88 | R2.1 v37.75,30.62 | R5.1 v43.38,14.25 | C3.2 v44.62,14.25 | D2.A v45.88,14.25 | R7.1 v43.38,9.38 | C9.2 v44.62,9.38 | D3.A v45.88,9.38
  Bottom 0.25: C49.2 v25,39.62 | C50.2 v23.75,39.62 | C52.1 v17.12,45.88 | C51.1 v31,39.62 | C53.1 v32.88,45.88 | v30.38,45 30.4,44.98 U4.3 U4.4
  Bottom 0.3: U4.33 24.68,50.18 v24.62,50.12 v24.62,49.5 v24.62,48.88 | U4.34 25.32,50.18 v25.38,50.12 v25.38,49.5 v25.38,48.88 | U4.41 29.76,50.14 v29.75,50.12 v29.75,49.5 v29.75,48.88 | U4.42 30.4,50.23 v30.5,50.12 v30.5,49.5 v30.5,48.88 | U4.26 20.25,51.24 v20.25,50.12 v20.25,49.5 v20.25,48.88 | U4.25 19.6,50.23 v19.5,50.12 v19.5,49.5 v19.5,48.88 | U4.12 24.68,44.93 v24.75,45 v24.75,45.62 | U4.13 24.05,44.95 v24,45 v24,45.62 | C56.2 v27.25,55.38 | C54.2 v22.75,55.38
  Bottom 0.5: C63.1 v40.75,103.12 | R32.1 v37.88,106.75 | R54.1 27.19,108.31 27.15,108.31 27.25,108.17 v27.25,106.75 | C86.1 v30.12,103.25 | R56.1 18.38,108.12 v18.38,106.75 | C89.1 v21.12,103.25 | R58.1 v9.25,106.75 | C92.1 v12.12,106.75 | C6.2 v8.88,34 | C5.2 v8.88,39 | v10.12,137.5 Q1.3 v11.25,138.62 | C7.2 v26.5,28.62 | C8.1 v22.62,25.88
  pour GND (isolate 0.15): 0,31.5 0,160 50,160 50,8.25 40.88,8.25 30.62,18.5 24.38,18.5 21.75,21.12 21.75,26.25 25.75,30.25 30.62,30.25 30.62,44.62 17.75,44.62 17.75,31.5
  pour PWR (isolate 0.15, rank 6): 0,47.12 0,160 50,160 50,47.12
N$1
  Bottom 0.25: U4.14 23.41,42.46 C50.1
N$2
  pour Bottom (rank 5): 16,70 0,70 0,122.5 16,122.5
N$3
  Top 1: 14,149.25 13.75,149.5
  Top 3: 13.75,149.5 HOLE4.1 | RL2.21 16,128.75 16,147.25 14,149.25
N$4
  Top 3: HOLE1.1 36.25,149.5 34,147.25 34,128.75 RL1.11
N$5
  Top 3: HOLE2.1 28.75,149.5 26.75,147.5 26.75,128.5 RL1.21
N$6
  Top 3: HOLE3.1 21.25,149.5 23.25,147.5 23.25,128.5 RL2.11
N$8
  Bottom 0.15: R2.2 U1.27
N$9
  Bottom 1: D1.A RL1.A2 26.75,141.5 12.25,141.5 | RL2.A2 12.25,141.5 | Q1.2 12.25,141.5
N$13
  Bottom 0.15: U5.1 25,22.5 R3.1 R4.2
N$14
  Bottom 0.25: U4.11 25.32,42.44 C49.1
N$16
  Top 0.15: C78.1 7.5,23 18.5,23 27.5,14 CN6.1
N$17
  Top 0.15: CN3.1 22.5,12.25 20.38,14.38 9.12,14.38 C76.1
N$18
  Top 0.15: C77.1 17.25,24.75 28.88,13.12 34,13.12 37.5,9.62 CN4.1
N$25
  Bottom 0.25: U4.2 31.03,42.16 C51.2 FB4.1
N$31
  Bottom 0.25: FB5.1 C52.2 18.21,43.38 18.33,43.5 U4.22
N$51
  Bottom 0.25: 31.67,43.5 31.79,43.38 C53.2 FB6.1
  Bottom 0.3: 31.67,43.5 U4.1
N$52
  Bottom 0.25: C61.1 U4.23
N$53
  Bottom 0.25: C61.2 15.62,54.12 15.5,54.25
  pour Bottom (isolate 0.15, rank 3): 20,50 20,52.5 18.75,53.75 0,53.75 0,70 16,70 16,60 17.5,60 22.5,55 22.5,50
N$54
  Bottom 0.25: C60.1 18.62,50 18.97,50.34 U4.24
N$55
  Bottom 0.25: C60.2 17.38,48.25 23.62,48.25 24.05,48.67 U4.32
  pour Bottom (isolate 0.15, rank 4): 25,50 25,87.5 16,87.5 16,60 17.5,60 23.75,53.75 23.75,50
N$56
  Bottom 0.25: U4.43 31.03,50.34 31.38,50 C59.1
N$57
  Bottom 0.25: U4.35 25.95,48.67 26.38,48.25 32.62,48.25 C59.2
  pour Bottom (isolate 0.15, rank 3): 26.25,50 26.25,53.75 31.25,58.75 31.25,70 25,70 25,50
N$58
  Bottom 0.25: C58.1 U4.44
N$59
  Bottom 0.25: C58.2 34.38,54.5
  pour Bottom (isolate 0.15, rank 4): 27.5,50 27.5,55 31.25,58.75 31.25,87.5 50,87.5 50,53.75 31.25,53.75 30,52.5 30,50
N$60
  Bottom 0.5: C64.1 39.62,105.62 37.88,103.88 R32.2
N$61
  Bottom 0.15: U4.5 29.13,42.5 29,42.38 29,34.88 14.75,20.62 C65.2
N$62
  Top 0.15: CN1.1 12.5,9.62 C65.1
N$63
  pour Bottom (rank 6): 50,87.5 31.5,87.5 31.5,122.5 50,122.5
N$75
  Bottom 0.15: U4.6 28.49,42.51 28.62,42.38 28.62,35 12.12,18.5 4.5,18.5 C76.2
N$76
  Bottom 0.15: U4.16 22.14,42.89 21.88,42.62 21.88,31 18.75,27.88 13.5,27.88 C77.2
N$77
  Bottom 0.15: U4.17 21.51,42.76 21.5,42.75 21.5,31.12 18.62,28.25 C78.2
N$79
  pour Bottom (rank 5): 34,70 23.75,70 23.75,122.5 34,122.5
N$82
  pour Bottom (rank 6): 25,87.5 13.5,87.5 13.5,122.5 25,122.5
N$87
  Bottom 0.5: C87.1 28.25,105.62 27.25,104.62 R54.2
N$88
  Bottom 0.5: C90.1 19.38,105.62 18.25,104.5 R56.2
N$89
  Bottom 0.5: C93.1 10.25,104.38 9.25,103.38 R58.2
N$91
  Bottom 0.15: U4.20 19.6,42.15 C94.1
N$92
  Bottom 0.15: U4.7 27.86,42.48 R61.2
N$93
  Bottom 0.15: U4.8 27.22,43.1 R62.2
N$94
  Bottom 0.15: U4.15 22.78,42.4 C95.2
PROC_!RESET  (via drill 0.3)
  Top 0.15: CN7.3 43.71,44.59 v43.12,44
  Bottom 0.15: U1.4 41.75,29.62 41.62,29.75 41.62,42.5 v43.12,44
PROC_SWCLK  (via drill 0.3)
  Top 0.15: v48.75,44.62 48.71,44.59 CN7.4
  Bottom 0.15: U1.22 39.85,21.27 41.5,19.62 45.12,19.62 47.38,21.88 47.38,38.75 48.5,39.88 48.5,44.38 v48.75,44.62
PROC_SWDIO  (via drill 0.3)
  Top 0.15: v48.12,45.88 48.11,45.85 CN7.2
  Bottom 0.15: U1.21 40.25,21.38 41.62,20 45,20 47,22 47,38.88 48.12,40 v48.12,45.88
PROC_UART_RX  (via drill 0.3)
  Top 0.15: v48.62,28.12 v44.88,28.12
  Bottom 0.15: v48.62,28.12 48.5,28 48.5,21.38 49.12,20.75 49.12,13.62 CN8.2 | v44.88,28.12 U1.9
PROC_UART_TX  (via drill 0.3)
  Top 0.15: v48.25,28.62 v44.5,28.62
  Bottom 0.15: v48.25,28.62 48.12,28.5 48.12,15.12 CN8.1 | v44.5,28.62 U1.8
PSU_12V_SENSE  (via drill 0.3)
  Top 0.15: v47.88,29.62 v43.25,29.62
  Bottom 0.15: R8.2 R7.2 C9.1 45.75,11.88 D3.K 45.88,13.25 46.75,14.12 46.75,19.38 47.75,20.38 47.75,29.5 v47.88,29.62 | v43.25,29.62 U1.7
PSU_VDD_AMP_SENSE  (via drill 0.3)
  Top 0.15: v46.62,20.12 46.62,24.25 v42.75,28.12
  Bottom 0.15: R6.2 R5.2 C3.1 44.75,16.88 D2.K 45.88,19.38 v46.62,20.12 | U1.6 v42.75,28.12
RLY_EN  (via drill 0.3)
  Top 0.15: v13.38,135.12 1.5,123.25 1.5,64.75 4.12,62.12 11,62.12 18.94,54.19 29.81,54.19 v34.62,49.38 | v36.12,47.88 36.38,47.62 36.38,28.75 v38.5,26.62
  Bottom 0.15: Q1.1 13.38,137.38 R1.2 v13.38,135.12 | v38.5,26.62 U1.24 | v36.12,47.88 v34.62,49.38
TPA_!CLIP
  Bottom 0.15: U4.21 18.97,44.84 21.38,47.25 34.88,47.25 36.5,45.62 36.5,35.38 41.25,30.62 U1.3
TPA_!FAULT
  Bottom 0.15: U4.19 20.24,45.61 21.5,46.88 34.75,46.88 36.12,45.5 36.12,35.25 40.75,30.62 U1.2
TPA_!RESET
  Bottom 0.15: U4.18 20.87,45.75 21.62,46.5 34.62,46.5 35.75,45.38 35.75,35.12 36.5,34.38 36.5,27.88 38.25,26.12 U1.23
VDD_AMP  (via drill 0.3, 1)
  Top 1: HOLE5.1 v41,60 v39,60 | v39,60 v37,60 v35,60 | HOLE5.1 45,61 v42,61 v40,61 v38,61 v36,61 35,61 | HOLE5.1 45,59 v42,59 v40,59 v38,59 v36,59 35,59 | v35,60 35,61 | 35,61 v35,62 v37,62 v39,62 v39,60 | v35,60 35,59 | 35,59 v35,58 v37,58 v39,58 v39,60
  PWR 1: U2.1 32.85,60.65 38.5,55
  Bottom 0.15: C55.2 33.75,26.25 37.62,22.38 37.62,19.75 R6.1
  Bottom 0.3: C56.1 27.22,52.85 U4.37 | C54.1 22.78,52.85 U4.30 | U4.30 22.78,50.15 v22.75,50.12 v22.75,49.5 v22.75,48.88 | U4.37 27.22,50.15 v27.25,50.12 v27.25,49.5 v27.25,48.88 | U4.30 U4.29 22.14,50.27 v22,50.12 v22,49.5 v22,48.88 | U4.30 U4.31 23.41,50.21 v23.5,50.12 v23.5,49.5 v23.5,48.88 | U4.37 U4.36 26.59,50.21 v26.5,50.12 v26.5,49.5 v26.5,48.88 | U4.37 U4.38 27.86,50.27 v28,50.12 v28,49.5 v28,48.88
  pour PWR (isolate 0.15, no thermals): 30.62,16.25 30.62,44.62 17.75,44.62 17.75,70 50,70 50,16.25